# Altium schematic sheet LCD_Connector.SchDoc
size A4; SheetNumber: 7; SheetTotal: 8
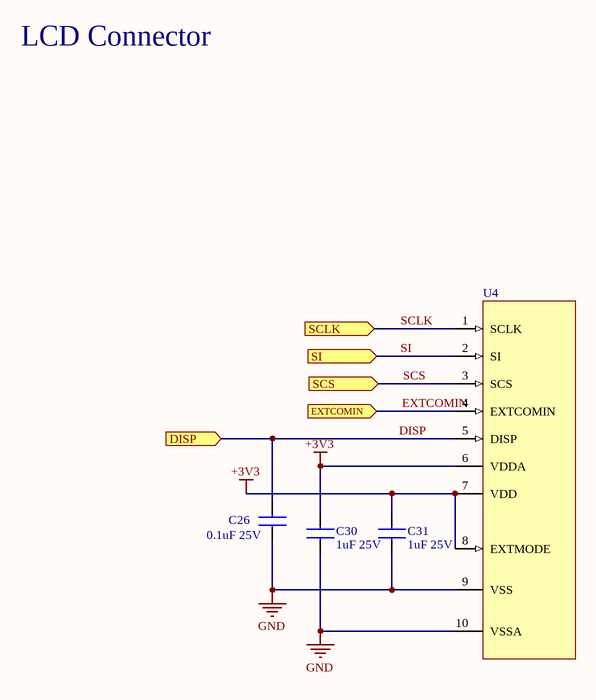
[diagram p0: LCD_Connector.SchDoc]

## Parts
C26  0.1uF 25V  [Chip2Pin_1.6x0.8x0.9_CAP]
C30  1uF 25V  [Chip2Pin_1.6x0.8x0.9_CAP]
C31  1uF 25V  [Chip2Pin_1.6x0.8x0.9_CAP]
U4  10 Position FFC, FPC Connector Contacts, Top and Bottom 0.020" (0.50mm) Surface Mount, Right Angle  [FFC_10POS_0.5MM_PITCH]  (value not drawn)

## Ports
DISP (in, see EFR32BG13_IO_Port_Pins[1C]), EXTCOMIN (in, see EFR32BG13_IO_Port_Pins[1C]), SCLK (in, see EFR32BG13_IO_Port_Pins[1C]), SCS (in, see EFR32BG13_IO_Port_Pins[1C]), SI (in, see EFR32BG13_IO_Port_Pins[1C])

## Nets
+3V3: C30.1 C31.1 U4.6(VDDA) U4.7(VDD) U4.8(EXTMODE)
GND: C26.2 C30.2 C31.2 U4.9(VSS) U4.10(VSSA)
DISP: C26.1 U4.5(DISP) ; port DISP
EXTCOMIN: U4.4(EXTCOMIN) ; port EXTCOMIN
SCLK: U4.1(SCLK) ; port SCLK
SCS: U4.3(SCS) ; port SCS
SI: U4.2(SI) ; port SI

## Notes on the sheet
- LCD Connector

## Library data of the parts
C26 = GCJ188R71E104KA12D: Cap Ceramic 0.1uF 25V X7R 10% Pad SMD 0603 Soft Termination 125C Automotive T/R; Manufacturer: Murata; Value: 100nF; Supplier 1: Arrow Electronics; Manufacturer Part Number: GCJ188R71E104KA12D; RoHS: Yes; Category: Ceramic Capacitors; Stock 1: 11360; Pricing 1: 1=0.14710, 10=0.11710, 25=0.11140, 100=0.11030, 250=0.10920, 500=0.10810, 1000=0.10700, 3000=0.10600, 6000=0.10490 (USD); Mounting Technology: Surface Mount; Case/Package: 0603; Case Code (Imperial): 0603; Case Code (Metric): 1608; Min Operating Temperature: -55°C; Max Operating Temperature: 125°C; Features: Soft Termination; Packaging: Tape and Reel; Tolerance: 10%; Voltage Rating: 25V; Ratings: AEC-Q200; RoHS Compliant: Yes; ComponentLink1URL: http://search.murata.co.jp/Ceramy/image/img/A01X/G101/ENG/GCJ188R71E104KA12-01.pdf?src-supplier=Digi-Key; ComponentLink1Description: http://search.murata.co.jp/Ceramy/image/img/A01X/G101/ENG/GCJ188R71E104KA12-01.pdf?src-supplier=Digi-Key
C30 C31 = GCM188R71E105KA64J: Cap Ceramic 1uF 25V X7R 10% Pad SMD 0603 125C Automotive T/R; Manufacturer: Murata; Supplier 1: Arrow Electronics; Manufacturer Part Number: GCM188R71E105KA64J; RoHS: Yes; Category: Ceramic Capacitors; Stock 1: 30000; Pricing 1: 10000=0.03520, 20000=0.03290, 30000=0.03110, 50000=0.03040, 100000=0.02490, 250000=0.02380 (USD); Mounting Technology: Surface Mount; Case/Package: 0603; Case Code (Imperial): 0603; Case Code (Metric): 1608; Weight: 0.000222oz; Min Operating Temperature: -55°C; Max Operating Temperature: 125°C; Value: 1uF; Tolerance: 10%; Dielectric: X7R; Packaging: Tape and Reel; Voltage Rating: 25V; Termination: SMD/SMT; Voltage Rating (DC): 25V; Package Quantity: 10000; Length: 1.6mm; Width: 0.8mm; Height: 0.8mm; Thickness: 0.035inch; Depth: 0.8mm; Ratings: AEC-Q200; Radiation Hardening: No; RoHS Compliant: Yes; ComponentLink1URL: http://www.mouser.com/ds/2/281/c03e-806517.pdf?src-supplier=Mouser; ComponentLink1Description: http://www.mouser.com/ds/2/281/c03e-806517.pdf?src-supplier=Mouser; ComponentLink2URL: http://www.murata.com/~/media/webrenewal/support/library/catalog/products/capacitor/mlcc/c03e.ashx?src-supplier=Digi-Key; ComponentLink2Description: http://www.murata.com/~/media/webrenewal/support/library/catalog/products/capacitor/mlcc/c03e.ashx?src-supplier=Digi-Key
U4 = AYF531035: CONN FFC FPC 10POS 0.50MM R/A; Manufacturer: Panasonic; Actuator Material: Polymer,Liquid Crystal Polymer; Contact Resistance: 80mR; Max Voltage Rating (DC): 5.05kV; Current Rating: 500mA; Voltage Rating: 50V; Number of Positions: 10; Contact Location: Dual; Pitch: 0.5mm; Supplier 1: Avnet; Manufacturer Part Number: AYF531035; RoHS: Yes; Category: FFC / FPC; Stock 1: 5000; Pricing 1: 5000=0.86580, 5100=0.85100, 11000=0.83620, 25000=0.82140, 50000=0.80660 (USD); Mounting Technology: Surface Mount; Contact Material: Copper Alloy; Contact Plating: Gold; Housing Material: Polymer; Min Operating Temperature: -55°C; Max Operating Temperature: 85°C; Number of Rows: 1; Package Quantity: 1000; Packaging: Tape and Reel; Termination: Solder; Number of Contacts: 10; Orientation: Right Angle; Series: Y5B; Radiation Hardening: No; Lead Free: Lead Free; Flammability Rating: UL94 V-0; RoHS Compliant: Yes; ComponentLink1URL: http://www.mouser.com/ds/2/315/Panasonic_Y5B_Y5BW%20Series-1076217.pdf?src-supplier=Mouser; ComponentLink1Description: http://www.mouser.com/ds/2/315/Panasonic_Y5B_Y5BW%20Series-1076217.pdf?src-supplier=Mouser; ComponentLink2URL: http://www.onlinecomponents.com/datasheet/ayf531035.aspx?p=41877477&src-supplier=Onlinecomponents.com; ComponentLink2Description: http://www.onlinecomponents.com/datasheet/ayf531035.aspx?p=41877477&src-supplier=Onlinecomponents.com; ComponentLink3URL: http://www.panasonic-electric-works.com/catalogues/downloads/connectors/ds_65315_en_y5b_y5bw.pdf?src-supplier=Avnet; ComponentLink3Description: http://www.panasonic-electric-works.com/catalogues/downloads/connectors/ds_65315_en_y5b_y5bw.pdf?src-supplier=Avnet; ComponentLink4URL: https://www3.panasonic.biz/ac/e_download/control/connector/fpc-ffc/catalog/con_eng_y5bw.pdf?src-supplier=Digi-Key; ComponentLink4Description: https://www3.panasonic.biz/ac/e_download/control/connector/fpc-ffc/catalog/con_eng_y5bw.pdf?src-supplier=Digi-Key